# Altium schematic sheet Memory_256M.SchDoc
size A3; SheetNumber: 7; SheetTotal: 12
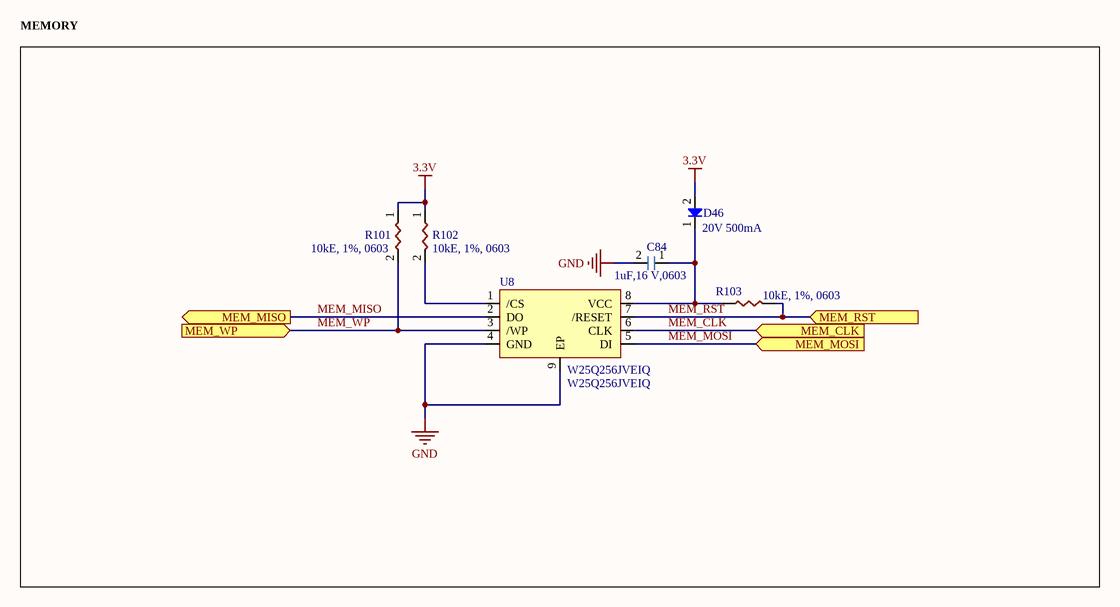
[diagram p0: Memory_256M.SchDoc]

## Parts
C84  Value Display: 1uF,16 V,0603  [CAPC1608X05N 0603]  (hidden comment: CGA3E1X7R1C105K080AC)
D46  Value Display: 20V 500mA  [DIODE_SOD123]  (hidden comment: SBR80520LT1G)
R101  Value Display: 10kE, 1%, 0603  [RESC1608X05N 0603]  (hidden comment: CRCW060310K0FKEA)
R102  Value Display: 10kE, 1%, 0603  [RESC1608X05N 0603]  (hidden comment: CRCW060310K0FKEA)
R103  Value Display: 10kE, 1%, 0603  [RESC1608X05N 0603]  (hidden comment: CRCW060310K0FKEA)
U8  W25Q256JVEIQ  [SON127P800X80_HS-9N]

## Blocks framed on the sheet
MEMORY: C84 D46 R101-R103 U8

## Ports
MEM_CLK (in), MEM_MISO (out), MEM_MOSI (in), MEM_RST (in), MEM_WP (in)

## Nets
3.3V: D46.2(Anode) R101.1 R102.1
GND: C84.2 U8.4(GND) U8.9(EP)
MEM_CLK: U8.6(CLK) ; port MEM_CLK
MEM_MISO: U8.2(DO) ; port MEM_MISO
MEM_MOSI: U8.5(DI) ; port MEM_MOSI
MEM_RST: R103.1 U8.7(/RESET) ; port MEM_RST
MEM_WP: R102.2 U8.3(/WP) ; port MEM_WP
NetC84_1: C84.1 D46.1(Cathode) R103.2 U8.8(VCC)
NetR101_2: R101.2 U8.1(/CS)

## Library data of the parts
C84 = Cap_CGA3E1X7R1C105K080AC: Multilayer Ceramic Capacitor, 1uF, 16V, ±10%,  X7R 0603 [1608 Metric]; Manufacturer: TDK Corporation; Polarized: No; AEC-Q: 200; Min Temp: -55 degC; Max Temp: 125 degC; Value: 1 uF; Manufacturer Part Number: CGA3E1X7R1C105K080AC; Package: 0603; RoHS: Yes; Mount Type: Surface Mount; Supplier 1: Digikey; Voltage: 16V; Tolerance: 10%; Technology: Ceramic; Value 1: CGA3E1X7R1C105K080AC; Category: Capacitor; ComponentLink1Description: Datasheet; ComponentLink1URL: https://product.tdk.com/system/files/dam/doc/product/capacitor/ceramic/mlcc/catalog/mlcc_automotive_general_en.pdf; Supplier 1 Part Number: 445-12539-1-ND; Supplier 1 pricing per Unit: 10.84 INR; Supplier: Mouser; Supplier Part Number: 810-CGA3E1X7R1C105AC; Supplier pricing per Unit: 10.01 INR; Temp Coefficient: X7R
D46 = Diode_SBR80520LT1G: Diode 20 V 500mA Surface Mount SOD-123; Manufacturer: OnSemi; AEC-Q: NA; Forward Voltage: 385 mV @ 500 mA; Max Temp: 125 degC; Min Temp: -65 degC; Voltage: 20V; Category: Diode; ComponentLink1Description: Datasheet; ComponentLink1URL: https://www.onsemi.com/pdf/datasheet/mbr0520lt1-d.pdf; Forward Current: 500mA; Manufacturer Part Number: SBR80520LT1G; Mount Type: Surface Mount; Package: SOD 123; RoHS: Yes; Supplier 1: Digikey; Supplier 1 Part Number: SBR80520LT1GOSCT-ND; Supplier 1 pricing per Unit: 34.22 INR; Supplier: Mouser; Supplier Part Number: 863-SBR80520LT1G; Supplier pricing per Unit: 34.19 INR; Value 1: SBR80520LT1G; Value: 20V 500mA
R101-R103 = Res_CRCW060310K0FKEA: SMD Chip Resistor, 10 kOhm,±1%, 100 mW, 0603 [1608 Metric], Thick Film, General Purpose; Manufacturer: Vishay Dale; AEC-Q: 200; Max Temp: 155 degC; Min Temp: -55 degC; Power: 1/10W; Value: 10k R; Category: Resistor; ComponentLink1Description: Datasheet; ComponentLink1URL: https://www.vishay.com/docs/20035/dcrcwe3.pdf; Manufacturer Part Number: CRCW060310K0FKEA; Mount Type: Surface Mount; Package: 0603; RoHS: Yes; Supplier 1: Digikey; Supplier 1 Part Number: 541-10.0KHCT-ND; Supplier 1 pricing per Unit: 8.34 INR; Supplier: Mouser; Supplier Part Number: 71-CRCW0603-10K-E3; Supplier pricing per Unit: 8.34 INR; Tolerance: 1%; Value 1: CRCW060310K0FKEA
U8 = IC_W25Q256JVEIQ: FLASH - NOR Memory IC 256Mbit SPI - Quad I/O 133 MHz 8-WSON (8x6); Manufacturer: Winbond; AEC-Q: NA; Max Temp: 85 degC; Min Temp: -40 degC; Value: 4 kb 256Mbit; Voltage: 3.3V; Category: Flash Memory; ComponentLink1Description: Datasheet; ComponentLink1URL: https://www.winbond.com/hq/support/documentation/levelOne.jsp?__locale=en&DocNo=DA00-W25Q256JV; Data Flash: 256Mbit; Manufacturer Part Number: W25Q256JVEIQ; Mount Type: Surface Mount; Package: WSON-8; RoHS: Yes; Supplier 1: Digikey; Supplier 1 Part Number: W25Q256JVEIQ-ND; Supplier 1 pricing per Unit: 268.68 INR; Supplier: Mouser; Supplier Part Number: 454-W25Q256JVEIQ; Supplier pricing per Unit: 267.71 INR; Value 1: W25Q256JVEIQ; Value Display: W25Q256JVEIQ